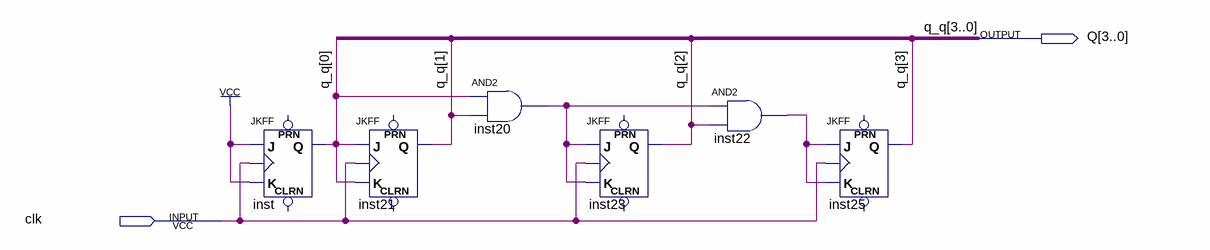
[diagram p0: schematic sheet]
// Quartus schematic sync_counter_JKTrigger.bdf as structural Verilog: 6 symbols, 2 pins
module sync_counter_JKTrigger (
  input  clk,
  output [3:0] Q
);

  wire inst20_out, inst22_out;

  JKFF inst (.K(1'b1), .J(1'b1), .CLK(clk), .Q(Q[0]));  // open: PRN, CLRN
  JKFF inst21 (.K(Q[0]), .J(Q[0]), .CLK(clk), .Q(Q[1]));  // open: PRN, CLRN
  and inst20 (inst20_out, Q[0], Q[1]);
  JKFF inst23 (.K(inst20_out), .J(inst20_out), .CLK(clk), .Q(Q[2]));  // open: PRN, CLRN
  and inst22 (inst22_out, inst20_out, Q[2]);
  JKFF inst25 (.K(inst22_out), .J(inst22_out), .CLK(clk), .Q(Q[3]));  // open: PRN, CLRN

  // Other names for the same wires on the sheet: q_q[3:0] = Q
endmodule
